# Altium schematic sheet Analog Filter-ADC interface.SchDoc: Analog Filter-ADC interface
size A4; DocumentNumber: GPH-3110-3; Revision: 1; SheetNumber: 3; SheetTotal: 6; SPICEModelCacheINAKYIWR: <root> / <DocumentId>INAKYIWR</DocumentId> / </root>
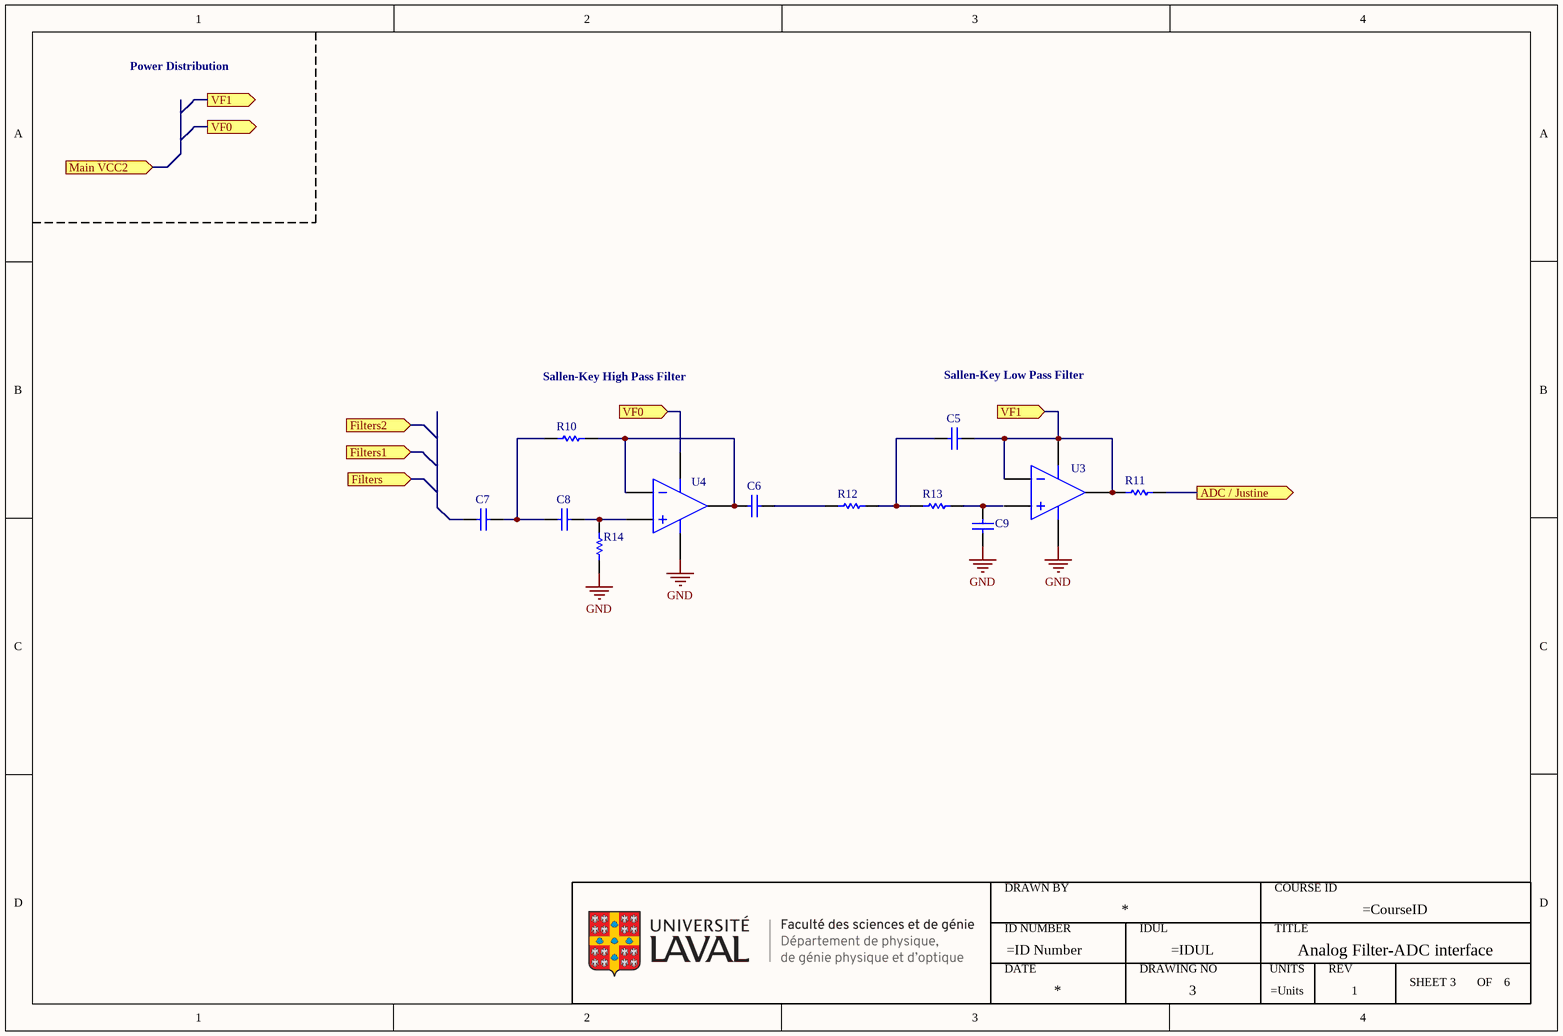
[diagram p0: Analog Filter-ADC interface.SchDoc]

## Parts
*3  ULaval FSG-DPGPO  (value not drawn)
C5  Capacitor  (value not drawn)
C6  Capacitor  (value not drawn)
C7  Capacitor  (value not drawn)
C8  Capacitor  (value not drawn)
C9  Capacitor  (value not drawn)
R10  Resistor  (value not drawn)
R11  Resistor  (value not drawn)
R12  Resistor  (value not drawn)
R13  Resistor  (value not drawn)
R14  Resistor  (value not drawn)
U3  Ideal Operational Amplifier  (value not drawn)
U4  Ideal Operational Amplifier  (value not drawn)

## Ports
ADC / Justine (out), Filters1 (in), Filters2 (in), Filters (in), Main VCC2 (in), VF0 (in), VF0 (out), VF1 (in), VF1 (out)

## Nets
GND: C9.2 R14.1 U3.5(V-) U4.5(V-)
ADC / Justine: R11.1 ; port ADC / Justine
VF0: U4.4(V+) ; port VF0
VF1: C5.2 R11.2 U3.1(IN-) U3.3(OUT) U3.4(V+) ; port VF1
NetC5_1: C5.1 R12.2 R13.2
NetC6_1: C6.1 R12.1
NetC6_2: C6.2 R10.2 U4.1(IN-) U4.3(OUT)
NetC7_2: C7.2 C8.1 R10.1
NetC8_2: C8.2 R14.2 U4.2(IN+)
NetC9_1: C9.1 R13.1

Not connected (* = marked no-connect by the designer): C7 1; U3 2(IN+)

## Notes on the sheet
- Power Distribution
- Sallen-Key High Pass Filter
- Sallen-Key Low Pass Filter
- (in symbol ULaval FSG-DPGPO) DRAWN BY; COURSE ID; ID NUMBER; IDUL; TITLE; DATE; DRAWING NO; UNITS; REV; SHEET; OF

## Library data of the parts
C5-C9 = Capacitor: SimulationGenericComponent: True; Value: 1p
R10-R14 = Resistor: TC1: 0; SimulationGenericComponent: True; Value: 1K; TC2: 0
U3 U4 = OpAmp with power terminals: SimulationGenericComponent: True; GAIN: 1